# Altium project PCB_Project1.PrjPCB
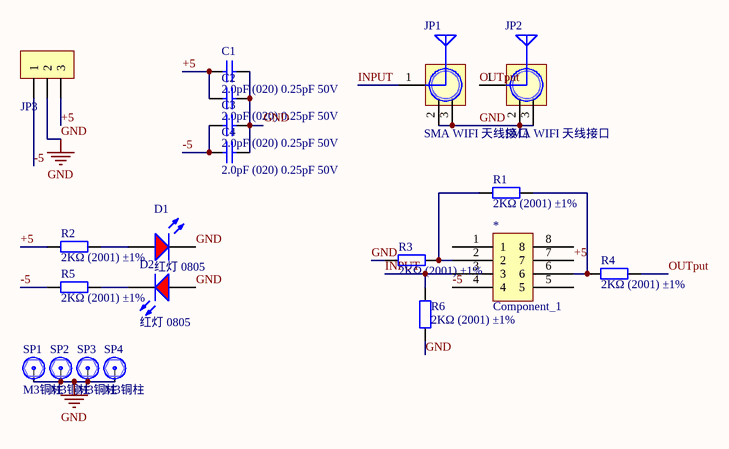
[diagram p0: OPA847.SchDoc]
1 sheet, 20 parts. Net scope: global (net labels, ports and power ports of the same name join across sheets).
Board file: OPA847.PcbDoc

## Sheet OPA847.SchDoc
size A4

### Parts
*  Component_1  [SOP8_N]
C1  2.0pF (020) 0.25pF 50V  [0603_C]
C2  2.0pF (020) 0.25pF 50V  [0603_C]
C3  2.0pF (020) 0.25pF 50V  [0603_C]
C4  2.0pF (020) 0.25pF 50V  [0603_C]
D1  红灯 0805  [0805_LED_S1]
D2  红灯 0805  [0805_LED_S1]
JP1  SMA WIFI 天线接口  [SMA-KE]
JP2  SMA WIFI 天线接口  [SMA-KE]
JP3  HDR-1X3  [XH2.54-WI-3P]  (value not drawn)
R1  2KΩ (2001) ±1%  [0805_R]
R2  2KΩ (2001) ±1%  [0805_R]
R3  2KΩ (2001) ±1%  [0805_R]
R4  2KΩ (2001) ±1%  [0805_R]
R5  2KΩ (2001) ±1%  [0805_R]
R6  2KΩ (2001) ±1%  [0805_R]
SP1  M3铜柱  [M3x4_L]
SP2  M3铜柱  [M3x4_L]
SP3  M3铜柱  [M3x4_L]
SP4  M3铜柱  [M3x4_L]

### Nets
GND: C1.2 C2.2 C3.2 C4.2 D1.K D2.A JP1.2(GND) JP1.3(GND) JP2.2(GND) JP2.3(GND) JP3.2 R3.1 R6.1 SP1.1 SP2.1 SP3.1 SP4.1
+5: *.7 C1.1 C2.1 JP3.3 R2.1
-5: *.4 C3.1 C4.1 JP3.1 R5.1
INPUT: *.3 JP1.1(ANT) R6.2
OUTput: JP2.1(ANT) R4.2
Net*_2: *.2 R1.1 R3.2
Net*_6: *.6 R1.2 R4.1
NetD1_A: D1.A R2.2
NetD2_K: D2.K R5.2

Not connected (* = marked no-connect by the designer): * 1 5 8

### Library data of the parts
C1-C4 = 0603 2.0pF (020) 0.25pF 50V: 贴片电容; ComponentLink1Description: 供应商链接; ComponentLink1URL: http://www.szlcsc.com/product/details_22617.html; Package: 0603; Supplier: LC; SuppliersPartNumber: C21895
D1 D2 = 0805 红灯: 发光二极管; ComponentLink1Description: 供应商链接; ComponentLink1URL: http://www.szlcsc.com/product/details_2668.html; Package: 0805; Supplier: LC; SuppliersPartNumber: C2295
JP1 JP2 = SMA: SMA-2.4G射频天线接口; BOM名称: SMA-2.4G射频天线接口
JP3 = Header 3: 3P接插件; BOM名称: 3P接插件
R1-R6 = 0805 2KΩ (2001) 1%: 贴片电阻; ComponentLink1Description: 供应商链接; ComponentLink1URL: http://www.szlcsc.com/product/details_18292.html; Package: 0805; Supplier: LC; SuppliersPartNumber: C17604
SP1-SP4 = 铜柱小焊盘: 铜柱; BOM名称: 铜柱